# EasyEDA Pro project ProPrj_esp_artnet_DMX_2024-10-07.epro

# Schematic Schematic1
Board Name: Board1; Create Date: 2024-09-13
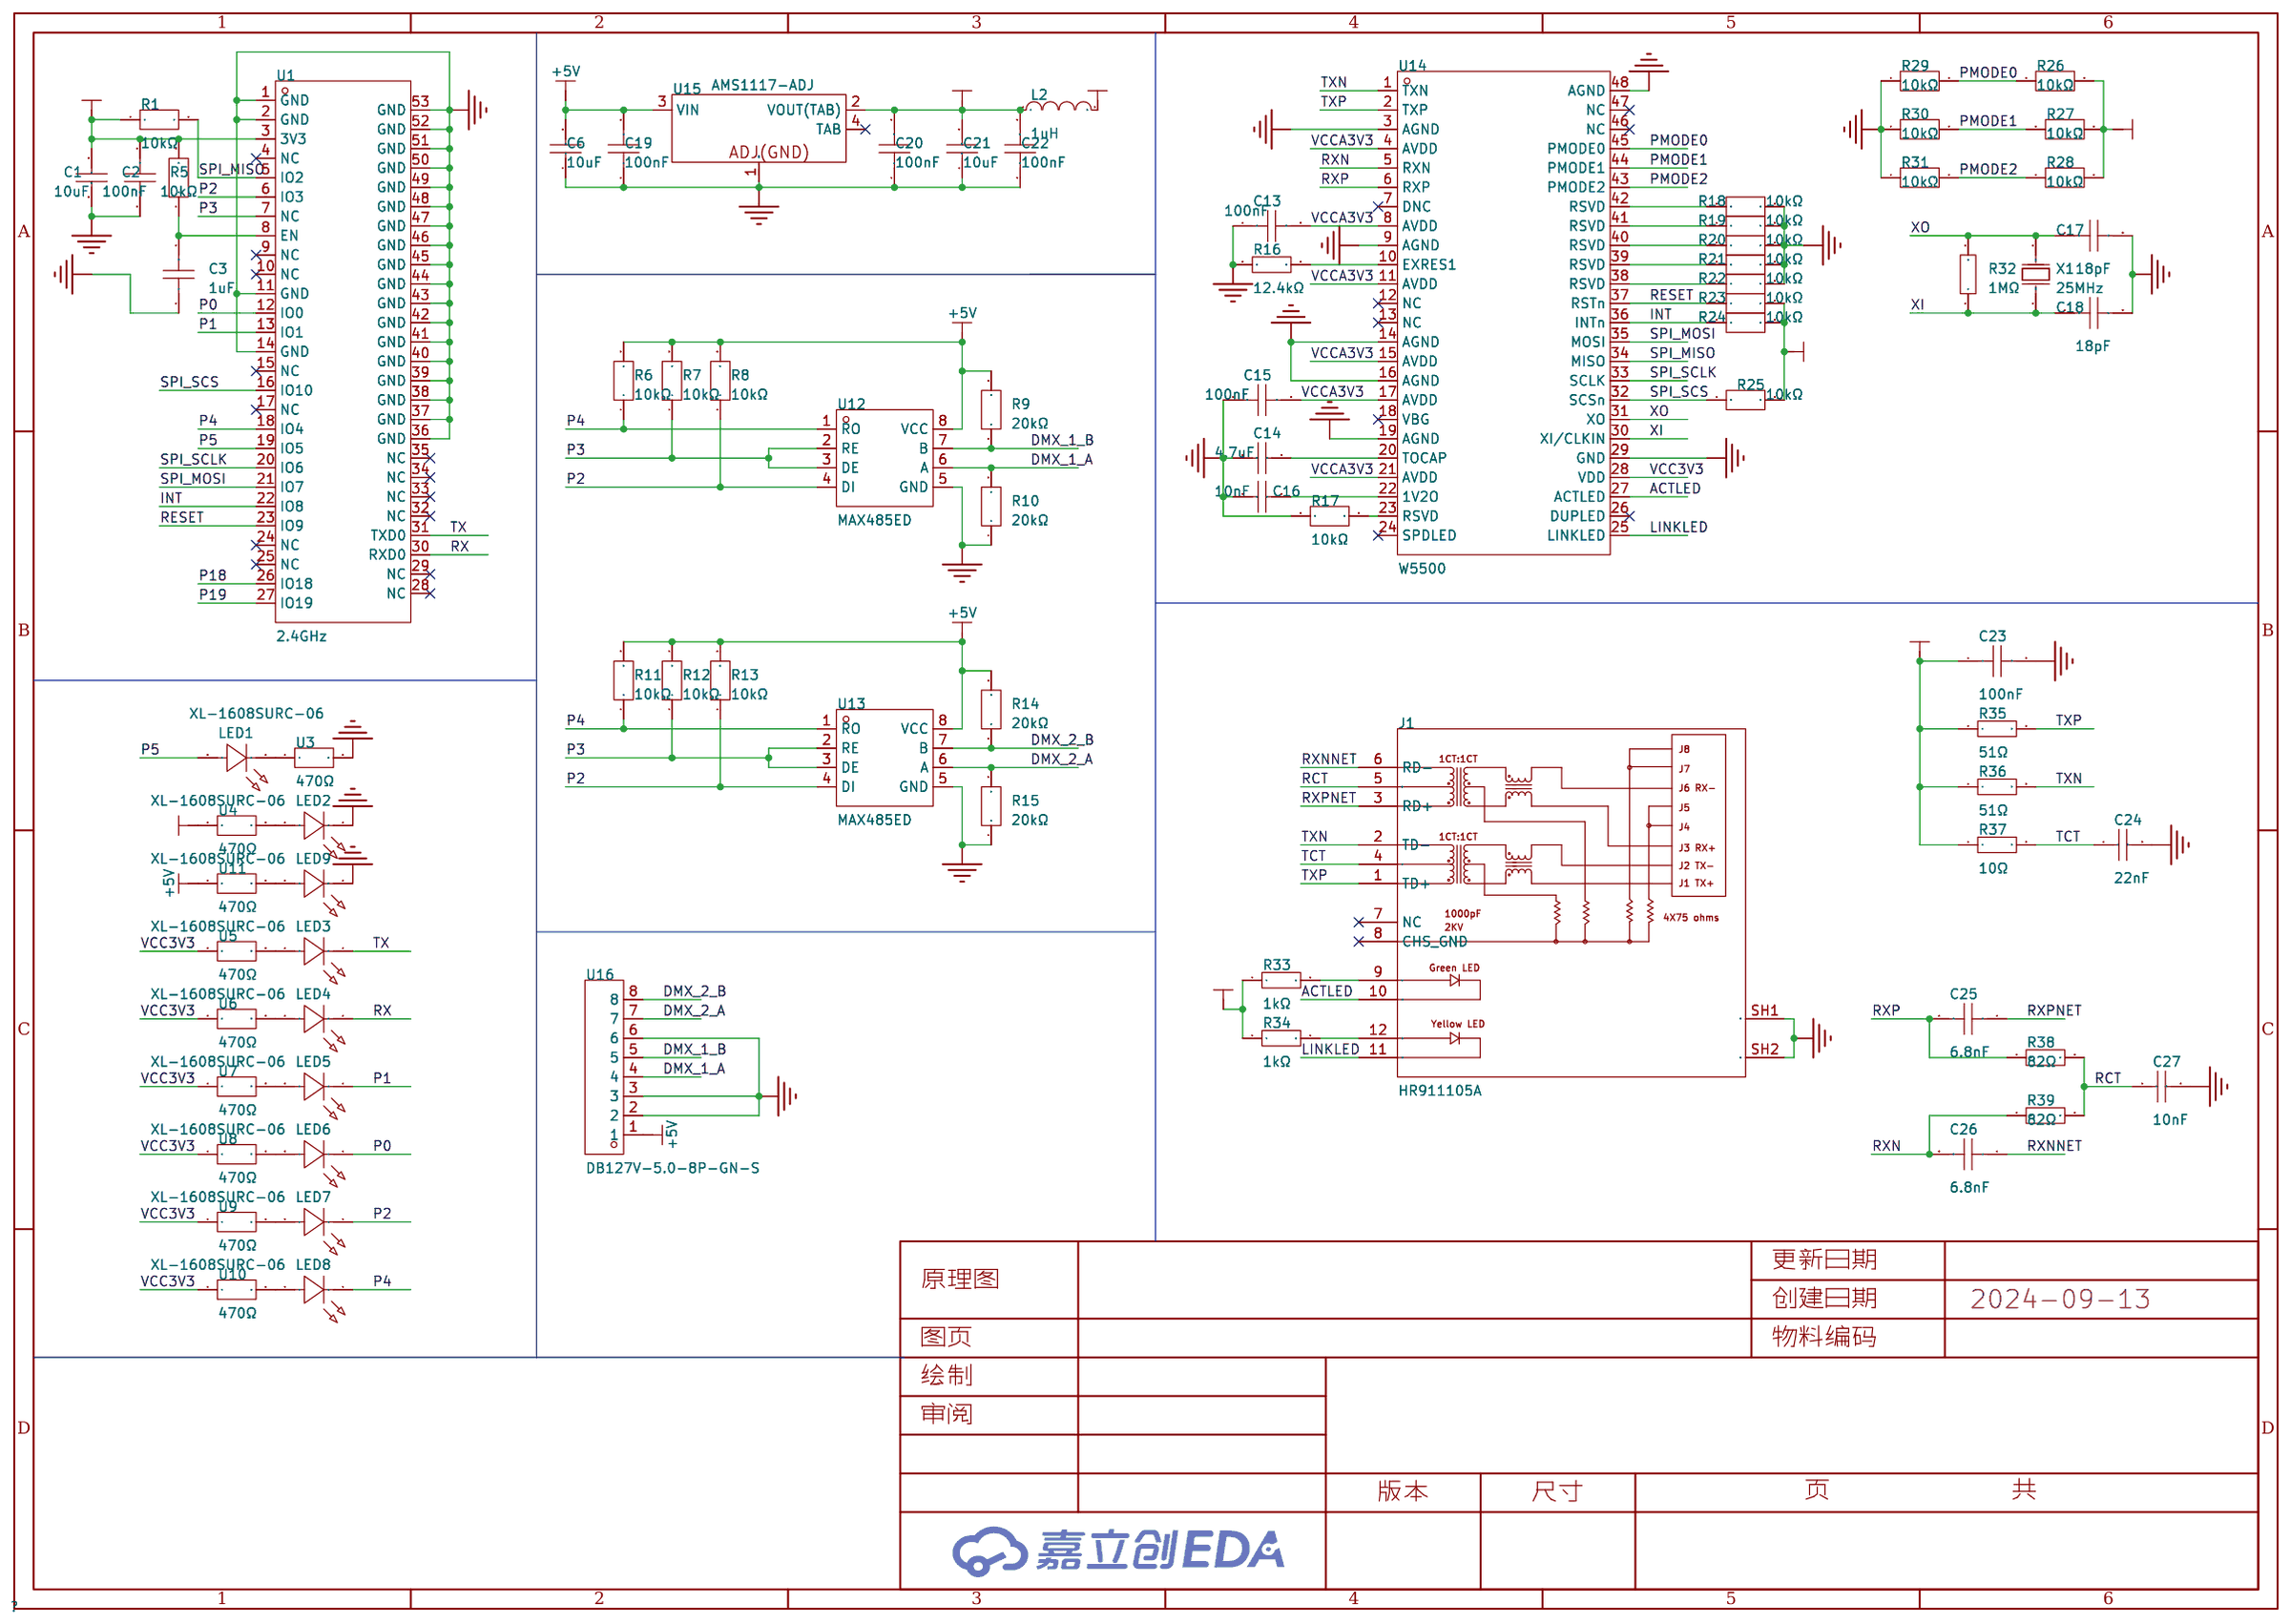
[diagram p0: schematic sheet]

## Parts
C1  10uF  [C0805]
C2  100nF  [C0603]
C3  1uF  [C0603]
C6  10uF  [C0805]
C13  100nF  [C0603]
C14  4.7uF  [C0603]
C15  100nF  [C0603]
C16  10nF  [C0603]
C17  18pF  [C0603]
C18  18pF  [C0603]
C19  100nF  [C0603]
C20  100nF  [C0603]
C21  10uF  [C0805]
C22  100nF  [C0603]
C23  100nF  [C0603]
C24  22nF  [C0603]
C25  6.8nF  [C0603]
C26  6.8nF  [C0603]
C27  10nF  [C0603]
J1  HR911105A  [RJ45-TH_HR911105A]
L2  1uH  [IND-SMD_L4.4-W4.2]
LED1  XL-1608SURC-06  [LED0603-RD_RED]
LED2  XL-1608SURC-06  [LED0603-RD_RED]
LED3  XL-1608SURC-06  [LED0603-RD_RED]
LED4  XL-1608SURC-06  [LED0603-RD_RED]
LED5  XL-1608SURC-06  [LED0603-RD_RED]
LED6  XL-1608SURC-06  [LED0603-RD_RED]
LED7  XL-1608SURC-06  [LED0603-RD_RED]
LED8  XL-1608SURC-06  [LED0603-RD_RED]
LED9  XL-1608SURC-06  [LED0603-RD_RED]
R1  10kΩ  [R0603]
R5  10kΩ  [R0603]
R6  10kΩ  [R0603]
R7  10kΩ  [R0603]
R8  10kΩ  [R0603]
R9  20kΩ  [R0603]
R10  20kΩ  [R0603]
R11  10kΩ  [R0603]
R12  10kΩ  [R0603]
R13  10kΩ  [R0603]
R14  20kΩ  [R0603]
R15  20kΩ  [R0603]
R16  12.4kΩ  [R0603]
R17  10kΩ  [R0603]
R18  10kΩ  [R0603]
R19  10kΩ  [R0603]
R20  10kΩ  [R0603]
R21  10kΩ  [R0603]
R22  10kΩ  [R0603]
R23  10kΩ  [R0603]
R24  10kΩ  [R0603]
R25  10kΩ  [R0603]
R26  10kΩ  [R0603]
R27  10kΩ  [R0603]
R28  10kΩ  [R0603]
R29  10kΩ  [R0603]
R30  10kΩ  [R0603]
R31  10kΩ  [R0603]
R32  1MΩ  [R0603]
R33  1kΩ  [R0603]
R34  1kΩ  [R0603]
R35  51Ω  [R0603]
R36  51Ω  [R0603]
R37  10Ω  [R0603]
R38  82Ω  [R0603]
R39  82Ω  [R0603]
U1  2.4GHz  [WIFIM-SMD_ESP32-C3-MINI-1]
U3  470Ω  [R0805]
U4  470Ω  [R0805]
U5  470Ω  [R0805]
U6  470Ω  [R0805]
U7  470Ω  [R0805]
U8  470Ω  [R0805]
U9  470Ω  [R0805]
U10  470Ω  [R0805]
U11  470Ω  [R0805]
U12  MAX485ED  [SOP-8_L4.9-W3.9-P1.27-LS6.0-BL]
U13  MAX485ED  [SOP-8_L4.9-W3.9-P1.27-LS6.0-BL]
U14  W5500  [LQFP-48_L7.0-W7.0-P0.50-LS9.0-BL]
U15  AMS1117-ADJ  [SOT-223_L6.7-W3.5-P2.30-BR]
U16  DB127V-5.0-8P-GN-S  [CONN-TH_8P-P5.00_DB127V-5.0-8P-GN-S]
X1  25MHz  [HC-49US_L11.5-W4.5-P4.88]

## Library data of the parts
C1 C6 C21 = CL21A106KPFNNNE: 容值:10uF;精度:±10%;额定电压:10V;材质(温度系数):X5R;; LCSC Part Name: 10uF ±10% 10V; Supplier Part: C17024; Manufacturer: SAMSUNG(三星); Supplier Footprint: 0805; JLCPCB Part Class: Extended Part; Datasheet: https://atta.szlcsc.com/upload/public/pdf/source/20160218/1457707763339.pdf; Supplier: LCSC; Tolerance: ±10%; Voltage Rated: 10V; Temperature Coefficient: X5R
C2 C13 C15 C19 C20 C22 C23 = CGA0603X7R104K500JT: 容值:100nF;精度:±10%;额定电压:50V;材质(温度系数):X7R;; LCSC Part Name: 100nF ±10% 50V; Supplier Part: C6119867; Manufacturer: HRE(芯声); Supplier Footprint: 0603; JLCPCB Part Class: 扩展库; Supplier: LCSC; Tolerance: ±10%; Voltage Rated: 50V; Temperature Coefficient: X7R
C3 = CL10A105KB8NNNC: 容值:1uF;精度:±10%;额定电压:50V;材质(温度系数):X5R;; LCSC Part Name: 1uF ±10% 50V; Supplier Part: C15849; Manufacturer: SAMSUNG(三星); Supplier Footprint: 0603; JLCPCB Part Class: 基础库; Datasheet: https://atta.szlcsc.com/upload/public/pdf/source/20160218/1457707763339.pdf; Supplier: LCSC; Tolerance: ±10%; Voltage Rated: 50V; Temperature Coefficient: X5R
C14 = CL10A475KO8NNNC: 容值:4.7uF;精度:±10%;额定电压:16V;材质(温度系数):X5R;; LCSC Part Name: 4.7uF ±10% 16V; Supplier Part: C19666; Manufacturer: SAMSUNG(三星); Supplier Footprint: 0603; JLCPCB Part Class: Basic Part; Datasheet: https://atta.szlcsc.com/upload/public/pdf/source/20160218/1457707763339.pdf; Supplier: LCSC; Tolerance: ±10%; Voltage Rated: 16V; Temperature Coefficient: X5R
C16 C27 = CC0603KRX7R9BB103: 容值:10nF;精度:±10%;额定电压:50V;材质(温度系数):X7R;; LCSC Part Name: 10nF ±10% 50V; Supplier Part: C100042; Manufacturer: YAGEO(国巨); Supplier Footprint: 0603; JLCPCB Part Class: 扩展库; Datasheet: https://atta.szlcsc.com/upload/public/pdf/source/20181008/C309510_22F155564471FAF6A489F7D68F34234E.pdf; Supplier: LCSC; Tolerance: ±10%; Voltage Rated: 50V; Temperature Coefficient: X7R
C17 C18 = FCC0603N180J500CT: 容值:18pF;精度:±5%;额定电压:50V;材质(温度系数):C0G;; LCSC Part Name: 18pF ±5% 50V; Supplier Part: C5137620; Manufacturer: FOJAN(富捷); Supplier Footprint: 0603; JLCPCB Part Class: 扩展库; Datasheet: https://atta.szlcsc.com/upload/public/pdf/source/20220818/0EB3B7FB2F5648AC16609637FBA7DABE.pdf; Supplier: LCSC; Tolerance: ±5%; Voltage Rated: 50V; Temperature Coefficient: C0G
C24 = CL10B223KB8NNNC: 容值:22nF;精度:±10%;额定电压:50V;材质(温度系数):X7R;; LCSC Part Name: 22nF ±10% 50V; Supplier Part: C21122; Manufacturer: SAMSUNG(三星); Supplier Footprint: 0603; JLCPCB Part Class: 基础库; Datasheet: https://atta.szlcsc.com/upload/public/pdf/source/20160218/1457707763339.pdf; Supplier: LCSC; Tolerance: ±10%; Voltage Rated: 50V; Temperature Coefficient: X7R
C25 C26 = GRM1885C1H682JA01D: 容值:6.8nF;精度:±5%;额定电压:50V;材质(温度系数):C0G;; LCSC Part Name: 6.8nF ±5% 50V; Supplier Part: C162241; Manufacturer: muRata(村田); Supplier Footprint: 0603; JLCPCB Part Class: 扩展库; Datasheet: https://atta.szlcsc.com/upload/public/pdf/source/20181017/C162241_2B9F8435DC08389FB8E3DBBBF64F69A3.pdf; Supplier: LCSC; Tolerance: ±5%; Voltage Rated: 50V; Temperature Coefficient: C0G
J1 = HR911105A_C12074: 连接器类型:RJ45插座;端口数量:1;安装方式:-;屏蔽:-;LED:带LED;等级:-;触头材质:-;触头镀层:-;工作温度范围:-;焊接温度(最大值):-;; LCSC Part Name: 带LED; Supplier Part: C12074; Manufacturer: HANRUN(汉仁); Supplier Footprint: 插件; JLCPCB Part Class: 扩展库; Datasheet: https://atta.szlcsc.com/upload/public/pdf/source/20170918/C12074_1505726819496976146.pdf; Supplier: LCSC; Connector Type: RJ45插座; Number of Ports: 1; LED: 带LED; PoE: 不带PoE; Supplementary Features: 带滤波
L2 = FXL0420-1R0-M: 电感值:1uH;精度:±20%;额定电流:6A;饱和电流(Isat):7A;类型:一体成型电感;; LCSC Part Name: 1uH ±20% 7A; Supplier Part: C167203; Manufacturer: cjiang(长江微电); Supplier Footprint: SMD,4.2x4.4mm; JLCPCB Part Class: 扩展库; Datasheet: https://atta.szlcsc.com/upload/public/pdf/source/20240426/3189EA8206330E2108542F9E34E540E7.pdf; Supplier: LCSC; Tolerance: ±20%; Rated Current: 6A; Saturation Current (Isat): 7A; DC Resistance (DCR): 27mΩ; Type: 一体成型电感
LED1-LED9 = XL-1608SURC-06: 发光颜色:红色;功率:55mW;正向电流:25mA;主波长:617nm~621nm;透镜颜色:无色透明透镜;色温:-;发光角度:120°;载带方式:正贴;工作温度:-30℃~+85℃;; Supplier Part: C965799; Manufacturer: XINGLIGHT(成兴光); Supplier Footprint: 0603; JLCPCB Part Class: 扩展库; Datasheet: https://atta.szlcsc.com/upload/public/pdf/source/20221102/D860AFDD1CDB02C5A8064103A32707E2.pdf; Supplier: LCSC; Emitted Color: 红色; Power Dissipation: 55mW; Forward Current: 25mA; Dominant Wavelength: 617nm~621nm; Peak Wavelength: 623nm; Lens Color: 无色透明透镜; Viewing Angle: 120°; Mounting Sytle: 正贴; Operating Temperature: -30℃~+85℃
R1 R5-R8 R11-R13 R17-R31 = FRC0603J103TS: 电阻类型:厚膜电阻;阻值:10kΩ;精度:±5%;功率:100mW;最大工作电压:75V;温度系数:±100ppm/℃;; LCSC Part Name: 10kΩ ±5% 100mW 厚膜电阻; Supplier Part: C2930027; Manufacturer: FOJAN(富捷); Supplier Footprint: 0603; JLCPCB Part Class: 扩展库; Datasheet: https://atta.szlcsc.com/upload/public/pdf/source/20211221/925EC7D7225764EE0046F22065062C87.pdf; Supplier: LCSC; Type: 厚膜电阻; Tolerance: ±5%; Power(Watts): 100mW; Overload Voltage (Max): 75V; Temperature Coefficient: ±100ppm/℃; Operating Temperature Range: -55℃~+155℃
R9 R10 R14 R15 = RT0603BRD0720KL: 电阻类型:薄膜电阻;阻值:20kΩ;精度:±0.1%;功率:100mW;最大工作电压:75V;温度系数:±25ppm/℃;; LCSC Part Name: 薄膜电阻 20kΩ ±0.1% 100mW; Supplier Part: C723637; Manufacturer: YAGEO(国巨); Supplier Footprint: 0603; JLCPCB Part Class: 扩展库; Datasheet: https://atta.szlcsc.com/upload/public/pdf/source/20200814/C723637_57E5E8B3C02F5D5BA42E401EB3E82C8B.pdf; Supplier: LCSC; Type: 薄膜电阻; Tolerance: ±0.1%; Power(Watts): 100mW; Overload Voltage (Max): 75V; Temperature Coefficient: ±25ppm/℃; Operating Temperature Range: -55℃~+155℃
R16 = 0603WAF1242T5E: 电阻类型:厚膜电阻;阻值:12.4kΩ;精度:±1%;功率:100mW;最大工作电压:75V;温度系数:±100ppm/℃;; LCSC Part Name: 12.4kΩ ±1% 100mW 厚膜电阻; Supplier Part: C22865; Manufacturer: UNI-ROYAL(厚声); Supplier Footprint: 0603; JLCPCB Part Class: 扩展库; Datasheet: https://atta.szlcsc.com/upload/public/pdf/source/20200306/C422600_1E6D84923E4A46A82E41ADD87F860B5C.pdf; Supplier: LCSC; Type: 厚膜电阻; Tolerance: ±1%; Power(Watts): 100mW; Overload Voltage (Max): 75V; Temperature Coefficient: ±100ppm/℃; Operating Temperature Range: -55℃~+155℃
R32 = 0603WAF1004T5E: 电阻类型:厚膜电阻;阻值:1MΩ;精度:±1%;功率:100mW;最大工作电压:75V;温度系数:±100ppm/℃;; LCSC Part Name: 1MΩ ±1% 100mW 厚膜电阻; Supplier Part: C22935; Manufacturer: UNI-ROYAL(厚声); Supplier Footprint: 0603; JLCPCB Part Class: 基础库; Datasheet: https://atta.szlcsc.com/upload/public/pdf/source/20200306/C422600_1E6D84923E4A46A82E41ADD87F860B5C.pdf; Supplier: LCSC; Type: 厚膜电阻; Tolerance: ±1%; Power(Watts): 100mW; Overload Voltage (Max): 75V; Temperature Coefficient: ±100ppm/℃; Operating Temperature Range: -55℃~+155℃
R33 R34 = 0603WAF1001T5E: 电阻类型:厚膜电阻;阻值:1kΩ;精度:±1%;功率:100mW;最大工作电压:75V;温度系数:±100ppm/℃;; LCSC Part Name: 1kΩ ±1% 100mW 厚膜电阻; Supplier Part: C21190; Manufacturer: UNI-ROYAL(厚声); Supplier Footprint: 0603; JLCPCB Part Class: Basic Part; Datasheet: https://atta.szlcsc.com/upload/public/pdf/source/20200306/C422600_1E6D84923E4A46A82E41ADD87F860B5C.pdf; Supplier: LCSC; Type: 厚膜电阻; Tolerance: ±1%; Power(Watts): 100mW; Overload Voltage (Max): 75V; Temperature Coefficient: ±100ppm/℃; Operating Temperature Range: -55℃~+155℃
R35 R36 = 0603WAF510JT5E: 电阻类型:厚膜电阻;阻值:51Ω;精度:±1%;功率:100mW;最大工作电压:75V;温度系数:±100ppm/℃;; LCSC Part Name: 51Ω ±1% 100mW 厚膜电阻; Supplier Part: C23197; Manufacturer: UNI-ROYAL(厚声); Supplier Footprint: 0603; JLCPCB Part Class: 基础库; Datasheet: https://atta.szlcsc.com/upload/public/pdf/source/20200306/C422600_1E6D84923E4A46A82E41ADD87F860B5C.pdf; Supplier: LCSC; Type: 厚膜电阻; Tolerance: ±1%; Power(Watts): 100mW; Overload Voltage (Max): 75V; Temperature Coefficient: ±100ppm/℃; Operating Temperature Range: -55℃~+155℃
R37 = 0603WAF100JT5E: 电阻类型:厚膜电阻;阻值:10Ω;精度:±1%;功率:100mW;最大工作电压:75V;温度系数:±400ppm/℃;; LCSC Part Name: 10Ω ±1% 100mW 厚膜电阻; Supplier Part: C22859; Manufacturer: UNI-ROYAL(厚声); Supplier Footprint: 0603; JLCPCB Part Class: 基础库; Datasheet: https://atta.szlcsc.com/upload/public/pdf/source/20200306/C422600_1E6D84923E4A46A82E41ADD87F860B5C.pdf; Supplier: LCSC; Type: 厚膜电阻; Tolerance: ±1%; Power(Watts): 100mW; Overload Voltage (Max): 75V; Temperature Coefficient: ±400ppm/℃; Operating Temperature Range: -55℃~+155℃
R38 R39 = 0603WAF820JT5E: 电阻类型:厚膜电阻;阻值:82Ω;精度:±1%;功率:100mW;最大工作电压:75V;温度系数:±100ppm/℃;; LCSC Part Name: 82Ω ±1% 100mW 厚膜电阻; Supplier Part: C23255; Manufacturer: UNI-ROYAL(厚声); Supplier Footprint: 0603; JLCPCB Part Class: 扩展库; Datasheet: https://atta.szlcsc.com/upload/public/pdf/source/20200306/C422600_1E6D84923E4A46A82E41ADD87F860B5C.pdf; Supplier: LCSC; Type: 厚膜电阻; Tolerance: ±1%; Power(Watts): 100mW; Overload Voltage (Max): 75V; Temperature Coefficient: ±100ppm/℃; Operating Temperature Range: -55℃~+155℃
U1 = ESP32-C3-MINI-1: 核心处理器:ESP32-C3芯片;频率:2.4GHz;天线形式:板载PCB天线;发射功率:-;接收灵敏度:-89dBm;; LCSC Part Name: 乐鑫ESP32 WiFi模块; Supplier Part: C5290152; Manufacturer: RF Crazy(智汉); JLCPCB Part Class: 扩展库; Datasheet: https://atta.szlcsc.com/upload/public/pdf/source/20230407/37C637B0DDC12E28939EC2C137730224.pdf; Supplier: LCSC; Core Processor: ESP32-C3芯片; Support Interface: UART; Antenna Type: 板载PCB天线; Operating Voltage: 3V~3.6V; Receive  Current: 82mA; Send  Current: 350mA; Sensitivity: -89dBm; Operating Temperature: -40℃~+81℃
U3-U11 = FRC0805J471 TS: 电阻类型:厚膜电阻;阻值:470Ω;精度:±5%;功率:125mW;最大工作电压:150V;温度系数:±100ppm/℃;; LCSC Part Name: 470Ω ±5% 125mW 厚膜电阻; Supplier Part: C2907329; Manufacturer: FOJAN(富捷); Supplier Footprint: 0805; JLCPCB Part Class: 扩展库; Datasheet: https://atta.szlcsc.com/upload/public/pdf/source/20211221/925EC7D7225764EE0046F22065062C87.pdf; Supplier: LCSC; Type: 厚膜电阻; Tolerance: ±5%; Power(Watts): 125mW; Overload Voltage (Max): 150V; Temperature Coefficient: ±100ppm/℃; Operating Temperature Range: -55℃~+155℃
U12 U13 = MAX485ED: Supplier Part: C481667; Manufacturer: HTC; Supplier Footprint: SOP-8; JLCPCB Part Class: 扩展库; Datasheet: https://atta.szlcsc.com/upload/public/pdf/source/20200113/C481667_86CA12344B2034BBC3F3085D860BEB7C.pdf; Supplier: LCSC
U14 = W5500: Hardwired TCP/IP embedded Ethernet controller that provides easier Internet connection to embedded systems; LCSC Part Name: 硬连线TCP/IP嵌入式以太网控制器; Supplier Part: C32843; Manufacturer: WIZNET; Supplier Footprint: LQFP-48(7x7); JLCPCB Part Class: 扩展库; Datasheet: https://atta.szlcsc.com/upload/public/pdf/source/20230714/E10C32B058E0BA54FCE1C1556BE10C07.pdf; Supplier: LCSC
U15 = AMS1117-ADJ_C347224: 输出类型:-;; LCSC Part Name: 输出可调 电流:1A 耐压:12V; Supplier Part: C347224; Manufacturer: UMW(友台半导体); Supplier Footprint: SOT-223; JLCPCB Part Class: 扩展库; Datasheet: https://atta.szlcsc.com/upload/public/pdf/source/20231109/155D79A26D9DB04352555A58D5969DC8.pdf; Supplier: LCSC
U16 = DB127V-5.0-8P-GN-S: 结构:1x8P;间距:5mm;颜色:绿色;安装方式:直插;额定电流:15A;额定电压:250V;排数:1;线规 - AWG:14~26;线规 - 平方毫米:1.5;每排PIN数:8;工作温度范围:-40℃~+105℃;; LCSC Part Name: 5mm 1x8P 排数:1 每排P数:8 直插; Supplier Part: C430626; Manufacturer: DORABO(地博电气); Supplier Footprint: 插件,P=5mm; JLCPCB Part Class: Extended Part; Datasheet: https://atta.szlcsc.com/upload/public/pdf/source/20230106/9CDB472D403F670588C42D375AEF1B30.pdf; Supplier: LCSC; Structure: 1x8P; Pitch: 5mm; Color: 绿色; Mounting Style: 直插; Current Rating (Max): 15A; Voltage Rating (Max): 250V; Number of Pins: 8P; Number of Rows: 1; Wire Gauge - AWG: 14~26; Wire Gauge - mm2: 1.5; Number of PINs Per Row: 8; Operating Temperature Range: -40℃~+105℃
X1 = B25000J288: 晶振类型:直插晶振;频率:25MHz;常温频差:±20ppm;外接负载电容:20pF;; LCSC Part Name: 25MHz ±20ppm 20pF; Supplier Part: C259035; Manufacturer: ECEC(东晶); Supplier Footprint: HC-49S; JLCPCB Part Class: 扩展库; Datasheet: https://atta.szlcsc.com/upload/public/pdf/source/20180928/C280058_735E219949BFDEF4DA8F2C5CC52AF4CF.pdf; Supplier: LCSC; Crystal Type: 直插晶振; Normal temperature Frequency Tolerance: ±20ppm; External load capacitor: 20pF; Equivalent Series Resistance (ESR): 30Ω; Operating Temperature: -20℃~+70℃

## Nets
+5V: C6.2 C19.2 R6.2 R7.2 R8.2 R9.2 R11.2 R12.2 R13.2 R14.2 U11.1 U12.8(VCC) U13.8(VCC) U15.3(VIN) U16.1
GND: C1.1 C2.1 C3.1 C6.1 C13.1 C14.1 C15.1 C16.1 C17.2 C18.2 C19.1 C20.1 C21.1 C22.1 C23.2 C24.2 C27.2 J1.SH1 J1.SH2 LED2.1(K) LED9.1(K) R10.1 R15.1 R16.1 R17.1 R18.2 R19.2 R20.2 R21.2 R22.2 R29.1 R30.1 R31.1 U1.1(GND) U1.2(GND) U1.11(GND) U1.14(GND) U1.36(GND) U1.37(GND) U1.38(GND) U1.39(GND) U1.40(GND) U1.41(GND) U1.42(GND) U1.43(GND) U1.44(GND) U1.45(GND) U1.46(GND) U1.47(GND) U1.48(GND) U1.49(GND) U1.50(GND) U1.51(GND) U1.52(GND) U1.53(GND) U3.2 U12.5(GND) U13.5(GND) U14.3(AGND) U14.9(AGND) U14.14(AGND) U14.16(AGND) U14.19(AGND) U14.29(GND) U14.48(AGND) U15.1(ADJ(GND)) U16.2 U16.3 U16.6
VCC3V3: C1.2 C2.2 C20.2 C21.2 C22.2 L2.1 R1.1 R5.2 R23.2 R24.2 R25.2 R26.2 R27.2 R28.2 R33.1 R34.1 U1.3(3V3) U4.1 U5.1 U6.1 U7.1 U8.1 U9.1 U10.1 U14.28(VDD) U15.2(VOUT(TAB))
VCCA3V3: C13.2 C15.2 C23.1 L2.2 R35.1 R36.1 R37.1 U14.4(AVDD) U14.8(AVDD) U14.11(AVDD) U14.15(AVDD) U14.17(AVDD) U14.21(AVDD)
ACTLED: J1.10 U14.27(ACTLED)
DMX_1_A: R10.2 U12.6(A) U16.4
DMX_1_B: R9.1 U12.7(B) U16.5
DMX_2_A: R15.2 U13.6(A) U16.7
DMX_2_B: R14.1 U13.7(B) U16.8
INT: R24.1 U1.22(IO8) U14.36(INTn)
LINKLED: J1.11 U14.25(LINKLED)
P0: LED6.1(K) U1.12(IO0)
P1: LED5.1(K) U1.13(IO1)
P2: LED7.1(K) R8.1 R13.1 U1.6(IO3) U12.4(DI) U13.4(DI)
P3: R7.1 R12.1 U1.7(NC) U12.2(RE) U12.3(DE) U13.2(RE) U13.3(DE)
P4: LED8.1(K) R6.1 R11.1 U1.18(IO4) U12.1(RO) U13.1(RO)
P5: LED1.2(A) U1.19(IO5)
P18: U1.26(IO18)
P19: U1.27(IO19)
PMODE0: R26.1 R29.2 U14.45(PMODE0)
PMODE1: R27.1 R30.2 U14.44(PMODE1)
PMODE2: R28.1 R31.2 U14.43(PMODE2)
RCT: C27.1 J1.5 R38.2 R39.2
RESET: R23.1 U1.23(IO9) U14.37(RSTn)
RX: LED4.1(K) U1.30(RXD0)
RXN: C26.2 R39.1 U14.5(RXN)
RXNNET: C26.1 J1.6(RD-)
RXP: C25.2 R38.1 U14.6(RXP)
RXPNET: C25.1 J1.3(RD+)
SPI_MISO: R1.2 U1.5(IO2) U14.34(MISO)
SPI_MOSI: U1.21(IO7) U14.35(MOSI)
SPI_SCLK: U1.20(IO6) U14.33(SCLK)
SPI_SCS: R25.1 U1.16(IO10) U14.32(SCSn)
TCT: C24.1 J1.4 R37.2
TX: LED3.1(K) U1.31(TXD0)
TXN: J1.2(TD-) R36.2 U14.1(TXN)
TXP: J1.1(TD+) R35.2 U14.2(TXP)
XI: C18.1 R32.1 U14.30(XI/CLKIN) X1.1(OSC1)
XO: C17.1 R32.2 U14.31(XO) X1.2(OSC2)
$1N1419: C3.2 R5.1 U1.8(EN)
$1N2958: LED1.1(K) U3.1
$1N3066: LED2.2(A) U4.2
$1N3181: LED3.2(A) U5.2
$1N3484: LED4.2(A) U6.2
$1N3569: LED5.2(A) U7.2
$1N3654: LED6.2(A) U8.2
$1N3739: LED7.2(A) U9.2
$1N3824: LED8.2(A) U10.2
$1N4019: LED9.2(A) U11.2
$1N11096: R16.2 U14.10(EXRES1)
$1N11405: C14.2 U14.20(TOCAP)
$1N11486: C16.2 U14.22(1V2O)
$1N11565: R17.2 U14.23(RSVD)
$1N11862: R18.1 U14.42(RSVD)
$1N11866: R19.1 U14.41(RSVD)
$1N11871: R20.1 U14.40(RSVD)
$1N11876: R21.1 U14.39(RSVD)
$1N11881: R22.1 U14.38(RSVD)
$1N15667: J1.9 R33.2
$1N15674: J1.12 R34.2

Not connected (* = marked no-connect by the designer): J1 7(NC)* 8(CHS GND)*; U1 4(NC)* 9(NC)* 10(NC)* 15(NC)* 17(NC)* 24(NC)* 25(NC)* 28(NC)* 29(NC)* 32(NC)* 33(NC)* 34(NC)* 35(NC)*; U14 7(DNC)* 12(NC)* 13(NC)* 18(VBG)* 24(SPDLED)* 26(DUPLED)* 46(NC)* 47(NC)*; U15 4(TAB)*

# Board PCB1
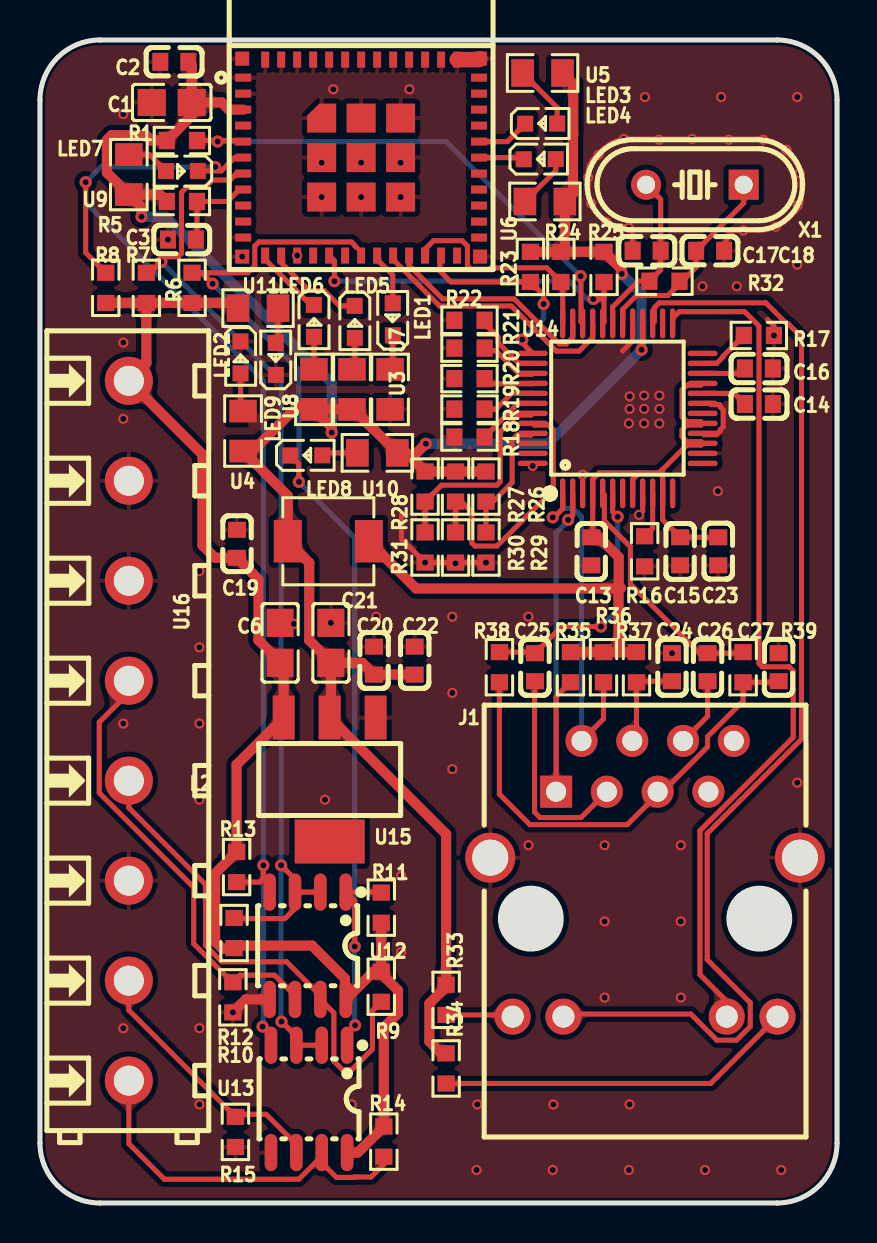
[diagram p1: board, top side]
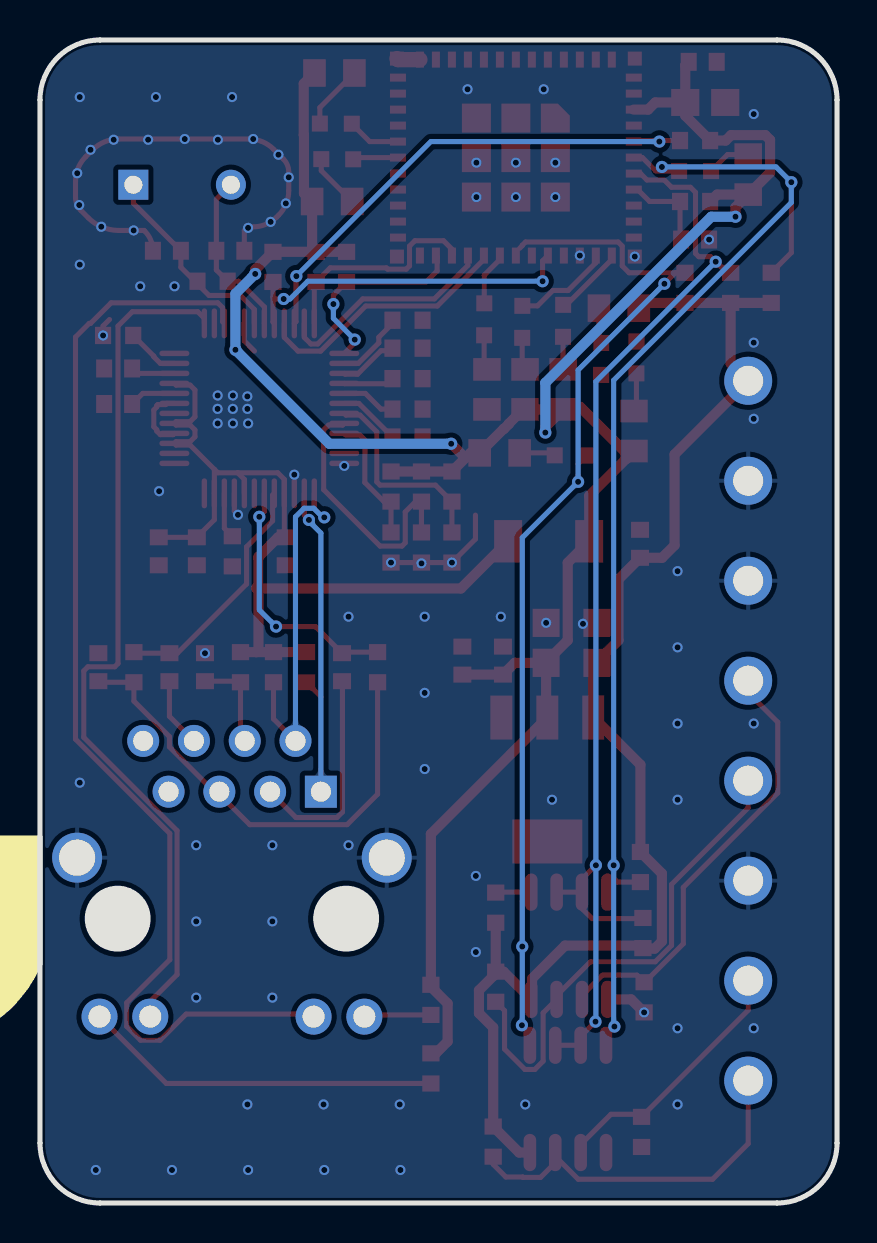
[diagram p2: board, bottom side, seen from below]

Outline 39.88 x 58.17 mm; copper layers: Top Layer, Bottom Layer. Coordinates in mm from the lower left corner of the outline.
Outline path: 0,55.17 0,3 arc(0.88,0.88) 3,0 36.88,0 arc(39,0.88) 39.88,3 39.88,55.17 arc(39,57.29) 36.88,58.17 3,58.17 arc(0.88,57.29) 0,55.17
Stack: Top Layer 0.035mm / Dielectric1 1.51mm FR4 er 4.5 / Bottom Layer 0.035mm

## Design rules (mm)
template: JLCPCB Capability(Two Layers Board)
spacing copperThickness1oz (default): track to track 0.102, other pairs 0.152 to 0.3
spacing copperThickness2oz: track to track 0.203, other pairs 0.152 to 0.3
track width copperThickness1oz (default): min 0.127, default 0.254, max 2.54
track width copperThickness2oz: min 0.203, default 0.254, max 2.54
differential pair differentialPair (default): width min 0.127, default 0.254, max 2.54; gap min 0.152, default 0.152
via viaSize (default): diameter min 0.5, default 0.61, max 10; hole min 0.3, default 0.305, max 6.3

## Placement (name value [footprint] x y rotation side)
C1  10uF  [C0805]  6.59 55.04 0 top
C2  100nF  [C0603]  6.72 57.07 0 top
C3  1uF  [C0603]  7.1 48.18 0 top
C6  10uF  [C0805]  12.01 28.02 270 top
C13  100nF  [C0603]  27.59 32.59 90 top
C14  4.7uF  [C0603]  35.97 39.96 180 top
C15  100nF  [C0603]  32.03 32.59 90 top
C16  10nF  [C0603]  35.97 41.74 180 top
C17  18pF  [C0603]  30.35 47.62 180 top
C18  18pF  [C0603]  33.53 47.62 0 top
C19  100nF  [C0603]  9.86 32.97 270 top
C20  100nF  [C0603]  16.71 27.13 270 top
C21  10uF  [C0805]  14.55 28.02 270 top
C22  100nF  [C0603]  18.75 27.13 270 top
C23  100nF  [C0603]  33.94 32.59 270 top
C24  22nF  [C0603]  31.62 26.8 90 top
C25  6.8nF  [C0603]  24.76 26.8 90 top
C26  6.8nF  [C0603]  33.4 26.8 90 top
C27  10nF  [C0603]  36.96 26.8 90 top
J1  HR911105A  [RJ45-TH_HR911105A]  30.27 16.22 0 top
L2  1uH  [IND-SMD_L4.4-W4.2]  14.43 33.1 180 top
LED1  XL-1608SURC-06  [LED0603-RD_RED]  17.65 44.2 90 top
LED2  XL-1608SURC-06  [LED0603-RD_RED]  10.03 42.29 270 top
LED3  XL-1608SURC-06  [LED0603-RD_RED]  25.08 53.98 0 top
LED4  XL-1608SURC-06  [LED0603-RD_RED]  25 52.2 0 top
LED5  XL-1608SURC-06  [LED0603-RD_RED]  15.75 44.07 270 top
LED6  XL-1608SURC-06  [LED0603-RD_RED]  13.71 44.12 270 top
LED7  XL-1608SURC-06  [LED0603-RD_RED]  7.1 51.61 180 top
LED8  XL-1608SURC-06  [LED0603-RD_RED]  13.32 37.39 0 top
LED9  XL-1608SURC-06  [LED0603-RD_RED]  11.8 42.22 90 top
R1  10kΩ  [R0603]  7.1 53.14 0 top
R5  10kΩ  [R0603]  7.1 50.09 180 top
R6  10kΩ  [R0603]  7.61 45.77 270 top
R7  10kΩ  [R0603]  5.32 45.77 270 top
R8  10kΩ  [R0603]  3.29 45.77 270 top
R9  20kΩ  [R0603]  17.08 10.82 90 top
R10  20kΩ  [R0603]  9.65 10.29 90 top
R11  10kΩ  [R0603]  17.08 14.77 270 top
R12  10kΩ  [R0603]  9.71 13.5 270 top
R13  10kΩ  [R0603]  9.84 16.8 90 top
R14  20kΩ  [R0603]  17.2 3.07 90 top
R15  20kΩ  [R0603]  9.78 3.56 90 top
R16  12.4kΩ  [R0603]  30.25 32.59 90 top
R17  10kΩ  [R0603]  35.97 43.39 180 top
R18  10kΩ  [R0603]  21.49 38.31 180 top
R19  10kΩ  [R0603]  21.49 39.71 180 top
R20  10kΩ  [R0603]  21.49 41.23 180 top
R21  10kΩ  [R0603]  21.49 42.75 180 top
R22  10kΩ  [R0603]  21.49 44.15 180 top
R23  10kΩ  [R0603]  24.54 46.82 90 top
R24  10kΩ  [R0603]  26.06 46.82 90 top
R25  10kΩ  [R0603]  28.22 46.82 90 top
R26  10kΩ  [R0603]  22.31 35.83 90 top
R27  10kΩ  [R0603]  20.79 35.83 90 top
R28  10kΩ  [R0603]  19.27 35.83 90 top
R29  10kΩ  [R0603]  22.31 32.78 90 top
R30  10kΩ  [R0603]  20.79 32.78 90 top
R31  10kΩ  [R0603]  19.27 32.78 90 top
R32  1MΩ  [R0603]  31.24 46.1 180 top
R33  1kΩ  [R0603]  20.32 10.16 270 top
R34  1kΩ  [R0603]  20.32 6.73 270 top
R35  51Ω  [R0603]  26.54 26.8 270 top
R36  51Ω  [R0603]  28.19 26.8 270 top
R37  10Ω  [R0603]  29.84 26.8 270 top
R38  82Ω  [R0603]  22.99 26.8 270 top
R39  82Ω  [R0603]  35.18 26.8 270 top
U1  2.4GHz  [WIFIM-SMD_ESP32-C3-MINI-1]  16.07 52.28 0 top
U3  470Ω  [R0805]  17.51 40.69 270 top
U4  470Ω  [R0805]  10.16 38.61 90 top
U5  470Ω  [R0805]  25.15 56.52 180 top
U6  470Ω  [R0805]  25.26 50.09 180 top
U7  470Ω  [R0805]  15.61 40.69 90 top
U8  470Ω  [R0805]  13.71 40.69 90 top
U9  470Ω  [R0805]  4.44 51.44 90 top
U10  470Ω  [R0805]  16.88 37.52 180 top
U11  470Ω  [R0805]  10.91 44.75 0 top
U12  MAX485ED  [SOP-8_L4.9-W3.9-P1.27-LS6.0-BL]  13.39 12.87 180 top
U13  MAX485ED  [SOP-8_L4.9-W3.9-P1.27-LS6.0-BL]  13.46 5.21 180 top
U14  W5500  [LQFP-48_L7.0-W7.0-P0.50-LS9.0-BL]  28.9 39.74 0 top
U15  AMS1117-ADJ  [SOT-223_L6.7-W3.5-P2.30-BR]  14.49 21.18 90 top
U16  DB127V-5.0-8P-GN-S  [CONN-TH_8P-P5.00_DB127V-5.0-8P-GN-S]  4.44 23.62 270 top
X1  25MHz  [HC-49US_L11.5-W4.5-P4.88]  32.77 50.93 180 top

## Footprints (pads in the part's own frame, mm; a bottom-side part is the same pattern mirrored in y, then rotated)
C0603
  rect 0.8x0.9 smd: 1(-0.7,0) 2(0.7,0)
C0805
  rect 1.41x1.35 smd: 1(-1,0) 2(1,0)
CONN-TH_8P-P5.00_DB127V-5.0-8P-GN-S
  round 2.4 hole 1.5: 1(-17.5,0) 2(-12.5,0) 3(-7.5,0) 4(-2.5,0) 5(2.5,0) 6(7.5,0) 7(12.5,0) 8(17.5,0)
HC-49US_L11.5-W4.5-P4.88
  rect 1.5x1.5 hole 0.9: 1(-2.44,0)
  round 1.5 hole 0.9: 2(2.44,0)
IND-SMD_L4.4-W4.2
  rect 1.4x2.12 smd: 1(2.028,0) 2(-2.028,0)
LED0603-RD_RED
  rect 0.8x0.8 smd: 1(-0.799,-0.004) 2(0.799,0.004)
LQFP-48_L7.0-W7.0-P0.50-LS9.0-BL
  oval 0.27x1.5 smd: 1(-2.75,-4.25) 2(-2.25,-4.25) 3(-1.75,-4.25) 4(-1.25,-4.25) 5(-0.75,-4.25) 6(-0.25,-4.25) 7(0.25,-4.25) 8(0.75,-4.25) 9(1.25,-4.25) 10(1.75,-4.25) 11(2.25,-4.25) 12(2.75,-4.25) 25(2.75,4.25) 26(2.25,4.25) 27(1.75,4.25) 28(1.25,4.25) 29(0.75,4.25) 30(0.25,4.25) 31(-0.25,4.25) 32(-0.75,4.25) 33(-1.25,4.25) 34(-1.75,4.25) 35(-2.25,4.25) 36(-2.75,4.25)
  oval 1.5x0.27 smd: 13(4.25,-2.75) 14(4.25,-2.25) 15(4.25,-1.75) 16(4.25,-1.25) 17(4.25,-0.75) 18(4.25,-0.25) 19(4.25,0.25) 20(4.25,0.75) 21(4.25,1.25) 22(4.25,1.75) 23(4.25,2.25) 24(4.25,2.75) 37(-4.25,2.75) 38(-4.25,2.25) 39(-4.25,1.75) 40(-4.25,1.25) 41(-4.25,0.75) 42(-4.25,0.25) 43(-4.25,-0.25) 44(-4.25,-0.75) 45(-4.25,-1.25) 46(-4.25,-1.75) 47(-4.25,-2.25) 48(-4.25,-2.75)
R0603
  rect 0.806x0.864 smd: 1(-0.753,0) 2(0.753,0)
R0805
  rect 1.133x1.377 smd: 1(-1,0) 2(1,0)
RJ45-TH_HR911105A
  rect 1.6x1.6 hole 1: 1(-4.45,4.355)
  round 1.6 hole 1: 2(-3.18,6.895) 3(-1.91,4.355) 4(-0.64,6.895) 5(0.63,4.355) 6(1.9,6.895) 7(3.17,4.355) 8(4.44,6.895)
  round 1.8 hole 1.1: 9(-6.625,-6.895) 10(-4.085,-6.895) 11(4.085,-6.895) 12(6.625,-6.895)
  round 2.5 hole 1.8: SH1(-7.745,1.055) SH2(7.745,1.055)
SOP-8_L4.9-W3.9-P1.27-LS6.0-BL
  oval 0.63x1.865 smd: 1(-1.905,-2.683) 2(-0.635,-2.683) 3(0.635,-2.683) 4(1.905,-2.683) 5(1.905,2.683) 6(0.635,2.683) 7(-0.635,2.683) 8(-1.905,2.683)
SOT-223_L6.7-W3.5-P2.30-BR
  rect 2.2x1.1 smd: 1(3.099,-2.3) 2(3.099,0) 3(3.099,2.3)
  rect 2.2x3.5 smd: 4(-3.099,0)
WIFIM-SMD_ESP32-C3-MINI-1
  rect 0.8x0.4 smd: 1(-5.9,4) 2(-5.9,3.2) 3(-5.9,2.4) 4(-5.9,1.6) 5(-5.9,0.8) 6(-5.9,0) 7(-5.9,-0.8) 8(-5.9,-1.6) 9(-5.9,-2.4) 10(-5.9,-3.2) 11(-5.9,-4) 25(5.9,-4) 26(5.9,-3.2) 27(5.9,-2.4) 28(5.9,-1.6) 29(5.9,-0.8) 30(5.9,0) 31(5.9,0.8) 32(5.9,1.6) 33(5.9,2.4) 34(5.9,3.2) 35(5.9,4)
  rect 0.4x0.8 smd: 12(-4.8,-4.9) 13(-4,-4.9) 14(-3.2,-4.9) 15(-2.4,-4.9) 16(-1.6,-4.9) 17(-0.8,-4.9) 18(0,-4.9) 19(0.8,-4.9) 20(1.6,-4.9) 21(2.4,-4.9) 22(3.2,-4.9) 23(4,-4.9) 24(4.8,-4.9) 36(4.8,4.9) 37(4,4.9) 38(3.2,4.9) 39(2.4,4.9) 40(1.6,4.9) 41(0.8,4.9) 42(0,4.9) 43(-0.8,4.9) 44(-1.6,4.9) 45(-2.4,4.9) 46(-3.2,4.9) 47(-4,4.9) 48(-4.8,4.9)
  custom 1.45x1.45 smd: 49(-1.975,1.975)
  rect 1.45x1.45 smd: 49(-1.975,0) 49(-1.975,-1.975) 49(0,1.975) 49(0,0) 49(0,-1.975) 49(1.975,1.975) 49(1.975,0) 49(1.975,-1.975)
  rect 0.7x0.7 smd: 50(5.95,4.95) 51(5.95,-4.95) 52(-5.95,-4.95) 53(-5.95,4.95)

## Nets
As in the schematic.

Pads without a net: J1 7 8; U1 4 9 10 15 17 24 25 28 29 32 33 34 35; U14 7 12 13 18 24 26 46 47; U15 4

## Via types
v1: diameter 0.61, hole 0.305, Top Layer to Bottom Layer, 26 vias
v2: diameter 0.508, hole 0.305, Top Layer to Bottom Layer, 89 vias

## Routing (per net, layer and track width the routed paths; a pad name or vN(x,y) marks a point on that pad's centre or on a via; arc(x,y) is an arc through that point)
+5V: length 68.3
  Top Layer w0.508: R9.2 17.2,11.44 17.2,11.35 17.91,10.63 17.91,9.49 17.2,8.78 17.2,3.82 15.9,2.52 U13.8 ; R9.2 16.69,11.57 U12.8 15.3,10.82 15.26,10.86 15.26,11.23 13.61,12.87 9.84,12.87 R12.2 9.66,12.75 9.63,12.72 9.12,12.72 8.76,13.08 8.76,16.48 R13.2 9.84,21.92 U15.3 12.19,26.84 C6.2 12.01,27.06 10.93,28.14 10.93,31.19 C19.2 8.75,32.27 8.13,32.89 8.13,37.44 U16.1 5.32,42 R7.2 ; R9.2 R11.2 ; R7.2 R6.2 9.79,45.02 9.91,45.14 ; R7.2 R8.2
GND: length 40.2
  Top Layer w0.254: v2(36.72,43.39) 36.72,43.86 36.4,44.19 ; v2(22.31,32.03) R30.1 v2(19.27,32.03) 18.09,33.21 18.09,34.4 ; U14.19 33.53,39.99 33.59,39.93 33.98,39.93 34.04,39.88 34.04,39.81 34.18,39.66 34.18,38.82 34.04,38.67 34.04,38.61 33.86,38.43 33.22,38.43 33.21,38.43 33.21,38.43 U14.16 ; 29.65,47.62 29.65,48.64 arc(29.45,48.77) 29.22,48.82 arc(28.76,48.88) v2(28.34,49.07) arc(28.18,49.18) 28.03,49.31 27.94,49.4 arc(27.72,49.67) 27.56,49.98 arc(27.46,50.3) 27.43,50.63 v2(27.43,51.3) 27.43,51.56 arc(27.5,51.91) 27.7,52.21 28.19,52.7 arc(28.76,53.08) 29.42,53.21 v2(32.63,53.21) 35.94,53.21 arc(36.65,53.07) 37.24,52.67 37.59,52.32 arc(37.88,51.95) 38.05,51.51 arc(38.09,51.31) 38.1,51.1 38.1,50.29 arc(38.07,50.07) 38,49.87 arc(37.92,49.75) 37.83,49.64 37.46,49.27 arc(37.16,49.02) v2(36.81,48.83) arc(36.39,48.69) 35.94,48.64 v2(35.19,48.64) 34.67,48.64 34.63,48.6 arc(34.33,48.15) C18.2 ; U14.29 29.65,43.12 29.15,42.61 ; v2(29.97,34.42) 30.15,34.6 U14.9
  Top Layer w0.508: v2(9.65,9.53) 10.3,10.18 U12.5
  Top Layer w0.762: U1.36 21.97,57.18 U1.50
  vias: v2(4.17,54.46) v2(4.17,43.03) v2(4.17,39.22) v2(4.17,23.98) v2(4.17,8.74) v2(6.4,48.18) v2(7.98,31.6) v2(7.98,27.79) v2(7.98,23.98) v2(7.98,20.17) v2(7.98,8.74) v2(7.98,4.93) v2(10.12,47.33) v2(12.71,28.97) v2(12.87,47.38) v2(14.09,52.03) v2(14.09,50.31) v2(14.26,20.17) v2(14.55,29.02) v2(14.68,55.7) v2(15.6,4.93) v2(16.07,52.03) v2(16.07,50.31) v2(16.82,29.32) v2(18.04,52.03) v2(18.04,50.31) v2(18.07,16.36) v2(18.07,12.55) v2(18.49,55.7) v2(20.63,29.32) v2(20.63,25.51) v2(20.63,21.7) v2(20.79,31.99) v2(21.84,1.65) v2(21.88,4.93) v2(24.44,29.32) v2(24.44,17.89) v2(24.65,36.86) v2(25.69,4.93) v2(25.65,1.65) v2(27.15,36.43) v2(27.58,49.99) v2(27.95,52.43) v2(28.25,17.89) v2(28.25,14.08) v2(28.25,10.27) v2(29.21,53.21) v2(29.47,48.77) v2(29.5,40.34) v2(29.5,39.72) v2(29.46,38.99) v2(29.5,4.93) v2(29.46,1.65) v2(30.23,40.39) v2(30.23,39.72) v2(30.23,38.99) v2(30.27,55.31) v2(30.98,53.18) v2(30.99,40.39) v2(30.99,39.72) v2(30.99,38.99) v2(31.62,27.5) v2(32.06,17.89) v2(32.06,14.08) v2(32.06,10.27) v2(33.15,45.85) v2(33.27,1.65) v2(33.92,35.6) v2(34.08,55.31) v2(34.47,53.18) v2(34.86,45.85) v2(36.19,53.18) v2(37.08,1.65) v2(37.35,52.67) v2(37.89,55.31) v2(37.92,49.91) v2(37.89,46.93) v2(37.89,21.02) v2(38.01,51.5)
VCC3V3: length 121.9
  Top Layer w0.254: v1(30.1,42.67) 30.15,42.73 U14.28
  Top Layer w0.508: 10.53,37.24 10.53,37.49 12.85,39.82 13.58,39.82 U8.1 ; 10.53,37.24 U4.1 ; 10.53,37.24 12.4,35.37 L2.1 13.47,32.02 13.47,28.14 14.55,27.06 C21.2 ; 10.53,37.24 10.51,37.23 ; R34.1 20.07,7.48 19.48,8.08 19.48,9.98 20.32,10.82 R33.1 20.32,18.45 U15.2 14.55,24.34 C21.2 ; R26.2 R27.2 R28.2 18.56,37.29 ; U9.1 5.08,49.8 v1(5.08,49.33) ; U9.1 3.35,51.53 3.35,53.17 3.59,53.41 5.3,53.41 5.57,53.14 R1.1 7.59,54.38 C1.2 ; U9.1 6,50.44 R5.2 ; v1(29.11,46.47) 29.11,46.68 R25.2 R24.2 ; v1(19.3,37.97) 18.62,37.29 18.56,37.29 ; 18.56,37.29 18.34,37.52 U10.1 16.68,38.72 16.66,38.72 16.42,38.96 16.42,38.98 15.71,39.69 U7.1 U8.1 ; C1.2 9.09,55.04 9.45,54.68 U1.3 ; C1.2 7.59,56.9 C2.2 ; R24.2 R23.2 ; R24.2 26.26,47.77 U6.1 26.67,50.5 26.67,53.41 26.68,53.42 26.68,55.98 U5.1 ; C21.2 16.12,27.02 C20.2 C22.2 ; v1(14.59,38.53) 14.59,38.8 U8.1
  Bottom Layer w0.508: v1(14.59,38.53) 14.59,41.02 6.29,49.33 v1(5.08,49.33) ; v1(29.11,46.47) 30.1,45.48 v1(30.1,42.67) 25.4,37.97 v1(19.3,37.97)
VCCA3V3: length 45.9
  Top Layer w0.254: 31.15,36.69 32.37,37.91 33.07,37.91 U14.15 33.07,38.08 32.37,38.08 32.12,38.32 32.12,38.66 32.37,38.91 33.07,38.91 U14.17 33.07,39.08 32.37,39.08 32.12,39.32 32.12,40.66 32.37,40.91 33.07,40.91 U14.21 ; 31.15,36.69 30.98,36.52 29.98,36.52 ; 31.15,36.69 U14.11 31.15,34.17 C15.2 C23.1 ; 29.98,36.52 27.98,36.52 27.65,36.19 U14.4 27.65,33.36 C13.2 ; 29.98,36.52 29.65,36.19 U14.8
  Top Layer w0.508: 29.03,30.73 28.95,30.65 28.95,27.66 29.06,27.55 ; 29.03,30.73 29.06,30.76 28.96,30.86 28.96,32.3 27.97,33.29 C13.2 ; 29.03,30.73 18.82,30.73 L2.2 ; 29.06,27.55 R36.1 R35.1 ; 29.06,27.55 R37.1
ACTLED: length 56.5
  Top Layer w0.254: U14.27 30.74,44.08 30.74,44.78 30.98,45.02 36.32,45.02 37.35,43.99 37.42,43.99 38.1,43.31 38.1,23.2 33.38,18.48 33.38,12.17 35.54,10.01 35.54,8.83 34.85,8.14 33.87,8.14 32.56,9.45 26.32,9.45 J1.10
DMX_1_A: length 22.3
  Top Layer w0.254: U12.6 12.76,10.37 11.73,11.39 10.01,11.39 R10.2 9.62,11.04 7.69,12.97 7.69,15.78 2.97,20.51 2.97,24.05 4.44,25.53 U16.4
DMX_1_B: length 25.2
  Top Layer w0.254: U16.5 4.44,19.77 8.28,15.93 8.28,12.88 9.1,12.07 12.33,12.07 14.03,10.37 U12.7 14.7,9.51 14.7,7.09 15.12,6.68 15.61,6.68 16.64,7.7 16.64,9.62 R9.1
DMX_2_A: length 13.1
  Top Layer w0.254: U13.6 12.83,2.92 11.31,4.44 9.91,4.44 R15.2 4.44,9.64 U16.7
DMX_2_B: length 18.6
  Top Layer w0.254: 14.1,2.34 12.95,1.19 6.22,1.19 4.44,2.97 U16.8 ; 14.1,2.34 U13.7 ; 14.1,2.34 14.1,2.02 14.83,1.28 15.71,1.28 15.73,1.3 16.57,1.3 17.2,1.94 R14.1
INT: length 10.9
  Top Layer w0.254: U1.22 19.2,47.45 19.2,47.64 19.69,48.13 21.12,48.13 21.39,47.86 21.39,46.87 21.55,46.71 22.48,46.71 22.55,46.77 25.36,46.77 R24.1 26.15,45.97 U14.36
LINKLED: length 43.6
  Top Layer w0.254: U14.25 31.65,44.25 31.99,44.58 35.25,44.58 35.97,43.86 35.97,26.98 36.14,26.82 37.48,26.82 37.69,26.61 37.69,23.29 33.02,18.62 33.02,11.42 34.43,10.01 34.43,9.65 34.36,9.58 J1.11
P0: length 3.6
  Top Layer w0.254: LED6.1 13.54,44.92 11.27,47.19 U1.12
P1: length 4.9
  Top Layer w0.254: U1.13 12.07,47.02 13.46,45.64 14.22,45.64 14.99,44.87 LED5.1
P2: length 64.2
  Top Layer w0.254: R8.1 2.29,47.53 v1(2.29,51.05) ; U1.6 9.74,52.28 9.07,51.62 LED7.1 ; U13.4 11.56,8.41 v1(11.14,8.82) ; 11.18,16.24 11.49,15.93 U12.4 ; 11.18,16.24 10.99,16.05 R13.1 ; 11.18,16.24 v1(11.18,16.89)
  Bottom Layer w0.254: v1(11.14,8.82) 11.18,8.86 v1(11.18,16.89) 11.18,41.15 2.29,50.04 v1(2.29,51.05) 3.05,51.82 v1(8.76,51.82)
P3: length 58.9
  Top Layer w0.254: U12.3 U12.2 ; U12.3 12.76,16.2 v1(12.06,16.89) ; U12.3 12.76,14.92 12.72,14.88 12.72,14.69 12.26,14.22 9.74,14.22 R12.1 ; U13.2 U13.3 12.83,8.33 v1(12.09,9.07) ; U1.7 9.83,51.48 9.51,51.16 8.64,51.16 8.28,50.8 7.34,50.8 7.08,50.54 7.08,47.49 6.92,47.33 6.32,47.33 v1(6.07,47.08) 5.52,46.52 R7.1
  Bottom Layer w0.254: v1(6.07,47.08) 12.06,41.08 v1(12.06,16.89) 12.06,9.09 v1(12.09,9.07)
P4: length 57.8
  Top Layer w0.254: 8.09,46.52 R6.1 ; 8.09,46.52 v1(8.64,45.97) ; 8.09,46.52 10.4,46.52 10.75,46.87 10.75,47.86 10.95,48.06 15.58,48.06 15.75,47.9 15.75,47.88 15.88,47.75 ; v1(15.75,12.83) 15.75,15.1 U12.1 17.05,15.55 R11.1 ; LED8.1 12.95,36.96 v1(12.95,36.07) ; U13.1 15.37,8.49 v1(15.77,8.89)
  Bottom Layer w0.254: v1(8.64,45.97) 12.95,41.66 v1(12.95,36.07) 15.75,33.27 v1(15.75,12.83) 15.75,8.91 v1(15.77,8.89)
P5: length 2.7
  Top Layer w0.254: U1.19 16.87,47.19 17.65,46.41 LED1.2
PMODE0: length 6.5
  Top Layer w0.254: U14.45 24.57,38.41 23.87,38.41 23.62,38.16 23.62,36.03 22.66,35.07 22.32,35.07 R26.1 R29.2
PMODE1: length 13.6
  Top Layer w0.254: R30.2 R27.1 21.09,35.08 21.6,34.56 21.6,33.02 21.77,32.85 22.86,32.85 25.68,35.67 25.68,38.66 25.44,38.91 24.74,38.91 U14.44
PMODE2: length 10.2
  Top Layer w0.254: R31.2 R28.1 20.09,35.9 22.86,35.9 23.03,36.07 23.03,38.56 23.87,39.41 24.57,39.41 U14.43
RCT: length 24.1
  Top Layer w0.254: R38.2 22.99,20.45 24.51,18.92 29.38,18.92 30.9,20.44 J1.5 31.16,20.57 33.4,22.81 33.4,23.32 35.18,25.1 R39.2 36.9,26.04 C27.1
RESET: length 10.1
  Top Layer w0.254: U14.37 24.13,43.02 v1(24.13,43.18) ; U1.23 20.01,47.32 20.01,46.61 20.56,46.06 R23.1 25.2,45.4 v1(25.2,44.96)
  Bottom Layer w0.254: v1(24.13,43.18) 25.2,44.25 v1(25.2,44.96)
RX: length 2.3
  Top Layer w0.254: LED4.1 24.12,52.28 U1.30
RXN: length 12.2
  Top Layer w0.254: U14.5 28.24,35.41 28.24,34.12 29.54,32.82 29.54,30.96 33,27.5 C26.2 35.13,27.5 R39.1
RXNNET: length 3.5
  Top Layer w0.254: C26.1 33.4,24.34 J1.6
RXP: length 12.8
  Top Layer w0.254: v1(28.9,34.32) 28.65,34.57 U14.6 ; R38.1 24.71,27.55 C25.2 26.1,28.83 v1(28.07,28.83)
  Bottom Layer w0.254: v1(28.9,34.32) 28.9,29.67 v1(28.07,28.83)
RXPNET: length 10.8
  Top Layer w0.254: C25.1 24.75,26.08 24.75,19.55 25.02,19.28 27.07,19.28 J1.3
SPI_MISO: length 25.7
  Top Layer w0.254: v1(27.05,46.35) 27.07,46.34 27.07,44.08 U14.34 ; 10.17,53.09 10.17,53.09 10.12,53.14 R1.2
  Bottom Layer w0.254: v1(27.05,46.35) 20.32,53.09 v1(8.89,53.09)
SPI_MOSI: length 11.1
  Top Layer w0.254: U1.21 18.47,46.89 20.14,45.22 23.73,45.22 25.98,42.96 26.32,42.96 26.65,43.29 U14.35
SPI_SCLK: length 13.1
  Top Layer w0.254: U14.33 27.65,43.29 26.97,42.61 25.83,42.61 23.58,44.86 20,44.86 17.67,47.19 U1.20
SPI_SCS: length 17.4
  Top Layer w0.254: v1(14.73,46.1) 14.73,47.12 U1.16 ; 28.22,45.31 28.12,45.21 v1(27.69,45.21) ; 28.22,45.31 28.22,44.06 U14.32 ; 28.22,45.31 R25.1
  Bottom Layer w0.254: v1(14.73,46.1) 26.48,46.1 27.37,45.21 v1(27.69,45.21)
TCT: length 4.8
  Top Layer w0.254: J1.4 29.84,23.32 R37.2 29.9,26.1 C24.1
TX: length 2.7
  Top Layer w0.254: U1.31 23.38,53.08 LED3.1
TXN: length 17.9
  Top Layer w0.254: v1(25.65,34.29) 25.77,34.41 25.84,34.41 26.15,34.72 U14.1 ; R36.2 28.19,24.21 J1.2
  Bottom Layer w0.254: v1(25.65,34.29) 25.77,34.41 25.84,34.41 26.18,34.75 26.66,34.75 27.09,34.32 J1.2
TXP: length 21
  Top Layer w0.254: R35.2 25.82,25.32 J1.1 ; v1(26.42,34.16) 26.65,34.39 U14.2
  Bottom Layer w0.254: v1(26.42,34.16) 26.24,33.98 26.24,33.92 25.82,33.51 J1.1
XI: length 10.4
  Top Layer w0.254: U14.30 29.15,44.69 29.85,45.39 31.42,45.39 32,45.97 R32.1 32.13,46.1 32.83,46.8 C18.1 35.21,50 X1.1
XO: length 8.6
  Top Layer w0.254: X1.2 31.05,50.2 C17.1 31.05,46.67 R32.2 29.94,46.1 28.65,44.81 28.65,44 U14.31
$1N1419: length 4.5
  Top Layer w0.254: U1.8 9.97,50.68 9.38,50.09 R5.1 7.85,48.24 C3.2
$1N2958: length 1.8
  Top Layer w0.254: U3.1 17.66,41.83 LED1.1
$1N3066: length 1.9
  Top Layer w0.254: LED2.2 10.04,39.73 U4.2
$1N3181: length 3.2
  Top Layer w0.254: LED3.2 25.88,54.79 U5.2
$1N3484: length 2.8
  Top Layer w0.254: LED4.2 25.8,51.63 U6.2
$1N3569: length 1.6
  Top Layer w0.254: LED5.2 15.75,41.83 U7.2
$1N3654: length 1.6
  Top Layer w0.254: LED6.2 13.71,41.69 U8.2
$1N3739: length 2.2
  Top Layer w0.254: U9.2 5.48,52.44 LED7.2
$1N3824: length 1.8
  Top Layer w0.254: U10.2 14.25,37.52 LED8.2
$1N4019: length 1.8
  Top Layer w0.254: LED9.2 11.91,43.13 U11.2
$1N11096: length 2.3
  Top Layer w0.254: R16.2 30.65,33.75 U14.10
$1N11405: length 2.3
  Top Layer w0.254: C14.2 34.73,40.49 U14.20
$1N11486: length 2.2
  Top Layer w0.254: C16.2 35.02,41.49 U14.22
$1N11565: length 2.7
  Top Layer w0.254: U14.23 33.85,41.99 34.18,42.32 34.18,42.36 R17.2
$1N11862: length 3.1
  Top Layer w0.254: U14.42 23.93,39.99 22.24,38.31
$1N11866: length 2.7
  Top Layer w0.254: 22.24,39.71 22.81,39.71 23.6,40.49 U14.41
$1N11871: length 2.6
  Top Layer w0.254: U14.40 24.64,40.98 22.37,40.98 22.24,41.1 22.24,41.23
$1N11876: length 3
  Top Layer w0.254: U14.39 24.61,41.45 23.99,41.45 22.81,42.63 22.37,42.63 22.24,42.75
$1N11881: length 3.9
  Top Layer w0.254: U14.38 23.95,41.99 22.93,43.02 22.93,43.3 22.35,43.87 22.14,43.87 22.05,43.96 22.24,44.15
$1N15667: length 3.4
  Top Layer w0.254: R33.2 23.56,9.41 J1.9
$1N15674: length 18
  Top Layer w0.254: J1.12 33.56,5.98 R34.2

## Copper pours and planes (outline as drawn; the poured copper is in the pictures)
GND on Top Layer: -3.3,60.58 44.83,60.58 44.83,-0.38 -3.3,-0.38
GND on Bottom Layer: -4.57,63.25 43.94,63.25 43.94,-0.63 -4.57,-0.63

Small or netless copper shapes (teardrops, artwork), in the pictures only: 286 on Top Layer, 29 on Bottom Layer
